# EAGLE design EEG-RM 040218P03 (EAGLE 7.6.0)
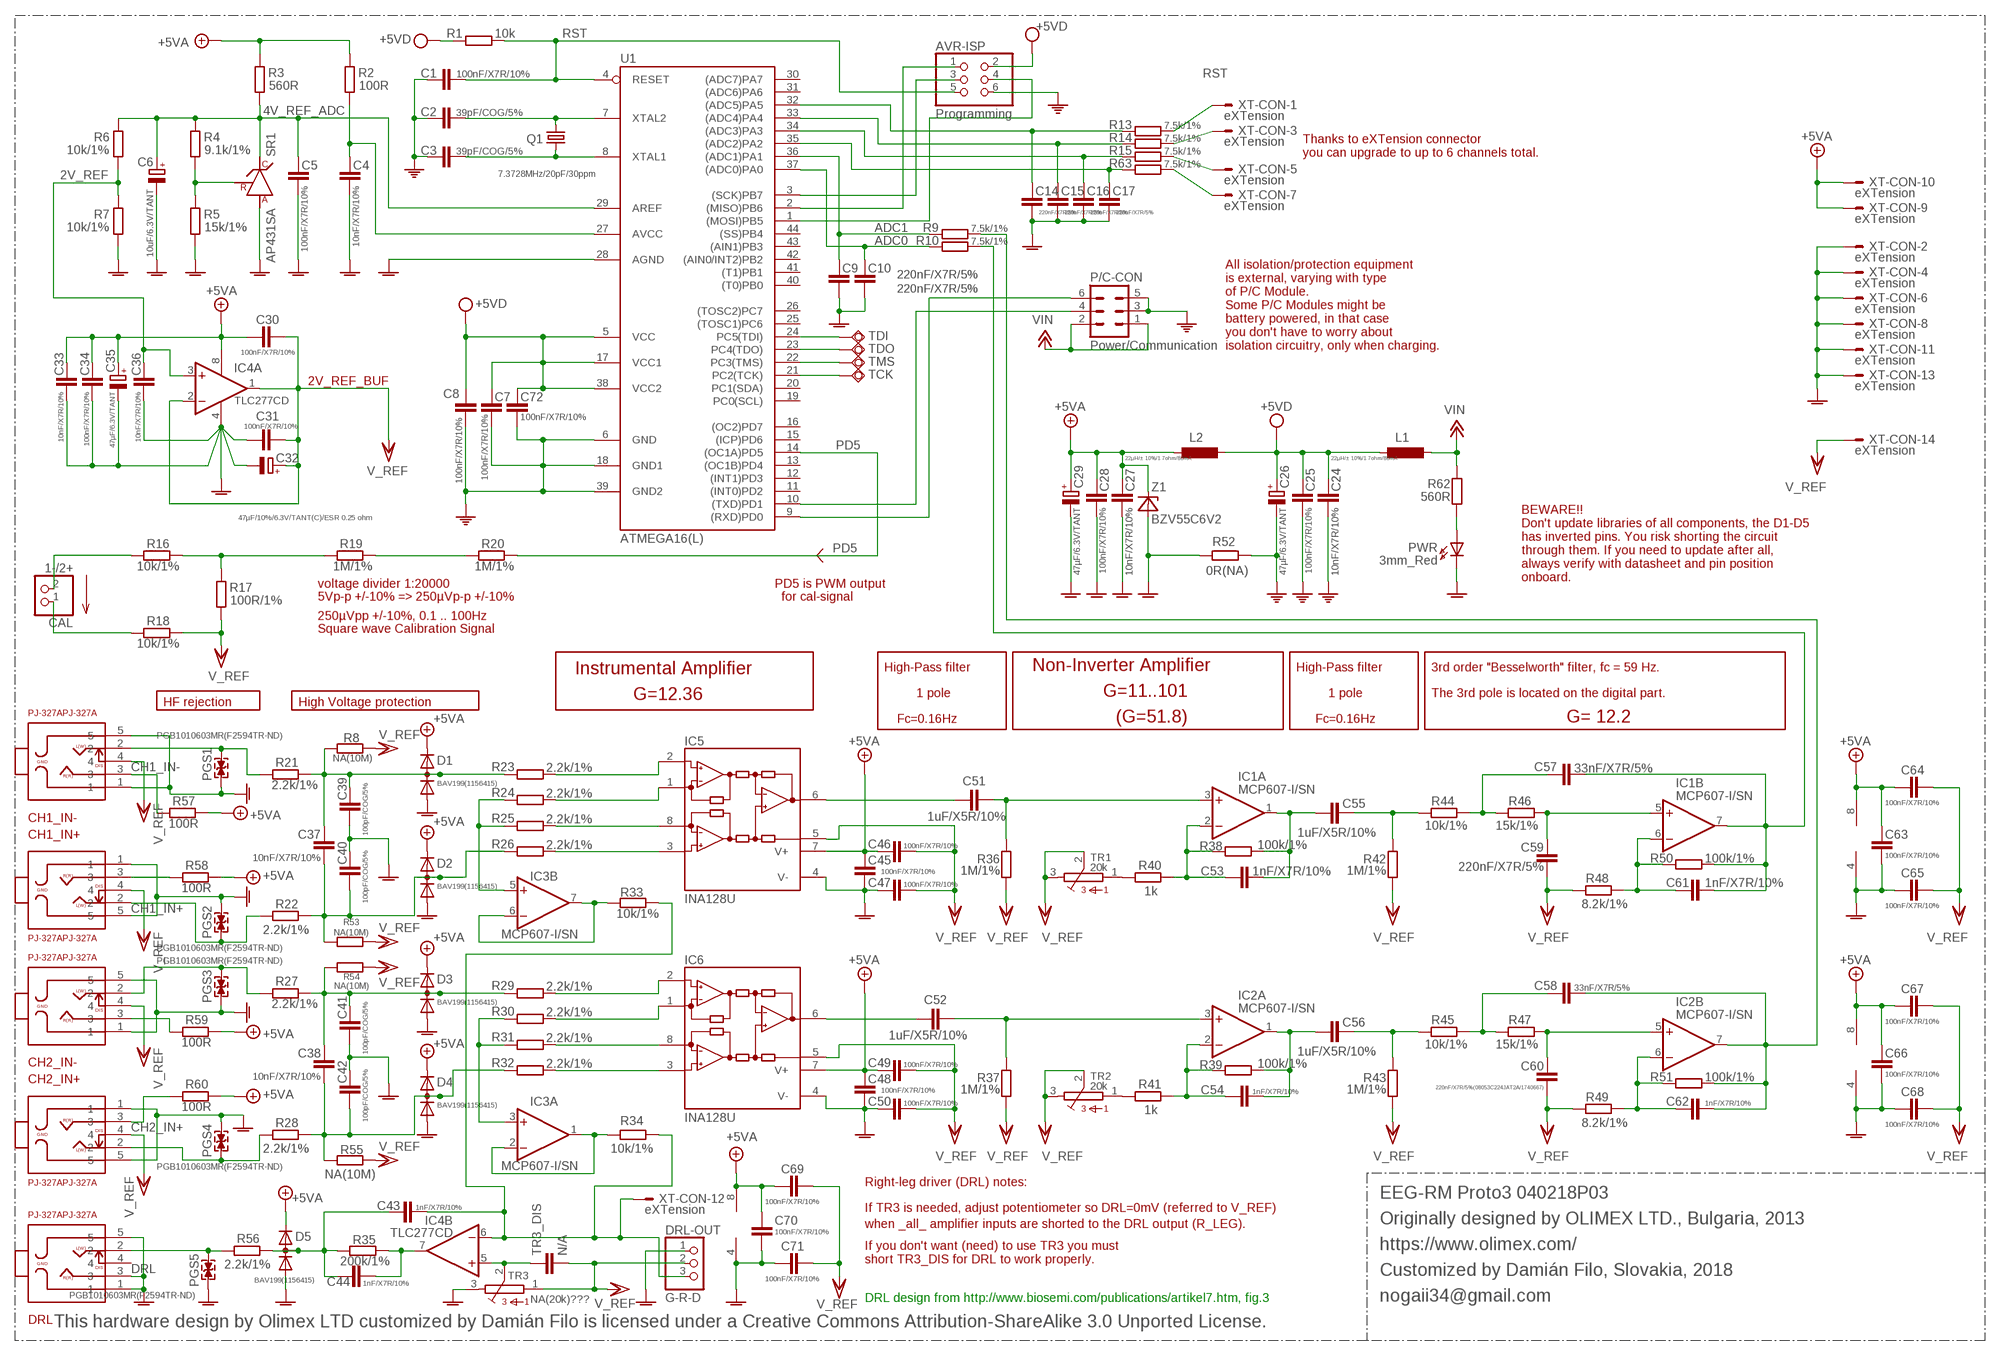
[diagram p0: schematic, sheet 1]

## Parts
AVR-ISP  Programming  PINHD-2X3  [2X03]
C1  100nF/X7R/10%  C-EUC0603  [C0603]
C2  39pF/COG/5%  C-EUC0603  [C0603]
C3  39pF/COG/5%  C-EUC0603  [C0603]
C4  10nF/X7R/10%  C-EUC0603  [C0603]
C5  100nF/X7R/10%  C-EUC0603  [C0603]
C6  10uF/6.3V/TANT  CPOL-EUCT3216  [CT3216]
C7  100nF/X7R/10%  C-EUC0603  [C0603]
C8  100nF/X7R/10%  C-EUC0603  [C0603]
C9  220nF/X7R/5%  C-EUC0603  [C0603]
C10  220nF/X7R/5%  C-EUC0603  [C0603]
C14  220nF/X7R/5%  C-EUC0603  [C0603]
C15  220nF/X7R/5%  C-EUC0603  [C0603]
C16  220nF/X7R/5%  C-EUC0603  [C0603]
C17  220nF/X7R/5%  C-EUC0603  [C0603]
C24  10nF/X7R/10%  C-EUC0603  [C0603]
C25  100nF/X7R/10%  C-EUC0603  [C0603]
C26  47µF/6.3V/TANT  CPOL-EUCT3216  [CT3216]
C27  10nF/X7R/10%  C-EUC0603  [C0603]
C28  100nF/X7R/10%  C-EUC0603  [C0603]
C29  47µF/6.3V/TANT  CPOL-EUCT3216  [CT3216]
C30  100nF/X7R/10%  C-EUC0603  [C0603]
C31  100nF/X7R/10%  C-EUC0603  [C0603]
C32  47µF/10%/6.3V/TANT(C)/ESR 0.25 ohm  CPOL-EUCT3528  [CT3528]
C33  10nF/X7R/10%  C-EUC0603  [C0603]
C34  100nF/X7R/10%  C-EUC0603  [C0603]
C35  47µF/6.3V/TANT  CPOL-EUCT3216  [CT3216]
C36  10nF/X7R/10%  C-EUC0603  [C0603]
C37  10nF/X7R/10%  C-EUC0603  [C0603]
C38  10nF/X7R/10%  C-EUC0603  [C0603]
C39  100pF/COG/5%  C-EUC0603  [C0603]
C40  100pF/COG/5%  C-EUC0603  [C0603]
C41  100pF/COG/5%  C-EUC0603  [C0603]
C42  100pF/COG/5%  C-EUC0603  [C0603]
C43  1nF/X7R/10%  C-EUC0603  [C0603]
C44  1nF/X7R/10%  C-EUC0603  [C0603]
C45  100nF/X7R/10%  C-EUC0603  [C0603]
C46  100nF/X7R/10%  C-EUC0603  [C0603]
C47  100nF/X7R/10%  C-EUC0603  [C0603]
C48  100nF/X7R/10%  C-EUC0603  [C0603]
C49  100nF/X7R/10%  C-EUC0603  [C0603]
C50  100nF/X7R/10%  C-EUC0603  [C0603]
C51  1uF/X5R/10%  C-EUC0603  [C0603]
C52  1uF/X5R/10%  C-EUC0603  [C0603]
C53  1nF/X7R/10%  C-EUC0603  [C0603]
C54  1nF/X7R/10%  C-EUC0603  [C0603]
C55  1uF/X5R/10%  C-EUC0603  [C0603]
C56  1uF/X5R/10%  C-EUC0603  [C0603]
C57  33nF/X7R/5%  C-EUC0603  [C0603]
C58  33nF/X7R/5%  C-EUC0603  [C0603]
C59  220nF/X7R/5%  C-EUC0603  [C0603]
C60  220nF/X7R/5%(08053C224JAT2A/1740667)  C-EUC0603  [C0603]
C61  1nF/X7R/10%  C-EUC0603  [C0603]
C62  1nF/X7R/10%  C-EUC0603  [C0603]
C63  100nF/X7R/10%  C-EUC0603  [C0603]
C64  100nF/X7R/10%  C-EUC0603  [C0603]
C65  100nF/X7R/10%  C-EUC0603  [C0603]
C66  100nF/X7R/10%  C-EUC0603  [C0603]
C67  100nF/X7R/10%  C-EUC0603  [C0603]
C68  100nF/X7R/10%  C-EUC0603  [C0603]
C69  100nF/X7R/10%  C-EUC0603  [C0603]
C70  100nF/X7R/10%  C-EUC0603  [C0603]
C71  100nF/X7R/10%  C-EUC0603  [C0603]
C72  100nF/X7R/10%  C-EUC0603  [C0603]
CAL  1-/2+  PINHD-1X2  [1X02]
CH1_IN+  PJ-327APJ-327A  [PJ-327A]
CH1_IN-  PJ-327APJ-327A  [PJ-327A]
CH2_IN+  PJ-327APJ-327A  [PJ-327A]
CH2_IN-  PJ-327APJ-327A  [PJ-327A]
D1  BAV199(1156415)  DIODE_AC-AC__  [SOT23C]
D2  BAV199(1156415)  DIODE_AC-AC__  [SOT23C]
D3  BAV199(1156415)  DIODE_AC-AC__  [SOT23C]
D4  BAV199(1156415)  DIODE_AC-AC__  [SOT23C]
D5  BAV199(1156415)  DIODE_AC-AC__  [SOT23C]
DRL  PJ-327APJ-327A  [PJ-327A]
DRL-OUT  G-R-D  PINHD-1X3  [1X03]
IC1  MCP607-I/SN  LM358D  [SO08]
IC2  MCP607-I/SN  LM358D  [SO08]
IC3  MCP607-I/SN  LM358D  [SO08]
IC4  TLC277CD  LM358D  [SO08]
IC5  INA128U  [SO08]
IC6  INA128U  [SO08]
L1  22µH/± 10%/1.7ohm/80mA  L-EUL2012C  [L2012C]
L2  22µH/± 10%/1.7ohm/80mA  L-EUL2012C  [L2012C]
P/C-CON  Power/Communication  ML6L  [ML6L]
PGS1  PGB1010603MR(F2594TR-ND)  [0603]
PGS2  PGB1010603MR(F2594TR-ND)  [0603]
PGS3  PGB1010603MR(F2594TR-ND)  [0603]
PGS4  PGB1010603MR(F2594TR-ND)  [0603]
PGS5  PGB1010603MR(F2594TR-ND)  [0603]
PWR  3mm_Red  LED3.0MM  [LED-3.0MM]
Q1  7.3728MHz/20pF/30ppm  HC49/S1  [HC49/SMD2_THIN]
R1  10k  R-EU_R0603  [R0603]
R2  100R  R-EU_R0603  [R0603]
R3  560R  R-EU_R0603  [R0603]
R4  9.1k/1%  R-EU_R0603  [R0603]
R5  15k/1%  R-EU_R0603  [R0603]
R6  10k/1%  R-EU_R0603  [R0603]
R7  10k/1%  R-EU_R0603  [R0603]
R8  NA(10M)  R-EU_R0603  [R0603]
R9  7.5k/1%  R-EU_M2012  [M2012]
R10  7.5k/1%  R-EU_M2012  [M2012]
R13  7.5k/1%  R-EU_M2012  [M2012]
R14  7.5k/1%  R-EU_M2012  [M2012]
R15  7.5k/1%  R-EU_M2012  [M2012]
R16  10k/1%  R-EU_R0603  [R0603]
R17  100R/1%  R-EU_R0603  [R0603]
R18  10k/1%  R-EU_R0603  [R0603]
R19  1M/1%  R-EU_R0603  [R0603]
R20  1M/1%  R-EU_R0603  [R0603]
R21  2.2k/1%  R-EU_R0603  [R0603]
R22  2.2k/1%  R-EU_R0603  [R0603]
R23  2.2k/1%  R-EU_R0603  [R0603]
R24  2.2k/1%  R-EU_R0603  [R0603]
R25  2.2k/1%  R-EU_R0603  [R0603]
R26  2.2k/1%  R-EU_R0603  [R0603]
R27  2.2k/1%  R-EU_R0603  [R0603]
R28  2.2k/1%  R-EU_R0603  [R0603]
R29  2.2k/1%  R-EU_R0603  [R0603]
R30  2.2k/1%  R-EU_R0603  [R0603]
R31  2.2k/1%  R-EU_R0603  [R0603]
R32  2.2k/1%  R-EU_R0603  [R0603]
R33  10k/1%  R-EU_R0603  [R0603]
R34  10k/1%  R-EU_R0603  [R0603]
R35  200k/1%  R-EU_R0603  [R0603]
R36  1M/1%  R-EU_R0603  [R0603]
R37  1M/1%  R-EU_R0603  [R0603]
R38  100k/1%  R-EU_R0603  [R0603]
R39  100k/1%  R-EU_R0603  [R0603]
R40  1k  R-EU_R0603  [R0603]
R41  1k  R-EU_R0603  [R0603]
R42  1M/1%  R-EU_R0603  [R0603]
R43  1M/1%  R-EU_R0603  [R0603]
R44  10k/1%  R-EU_R0603  [R0603]
R45  10k/1%  R-EU_R0603  [R0603]
R46  15k/1%  R-EU_R0603  [R0603]
R47  15k/1%  R-EU_R0603  [R0603]
R48  8.2k/1%  R-EU_R0603  [R0603]
R49  8.2k/1%  R-EU_R0603  [R0603]
R50  100k/1%  R-EU_R0603  [R0603]
R51  100k/1%  R-EU_R0603  [R0603]
R52  0R(NA)  R-EU_R0603  [R0603]
R53  NA(10M)  R-EU_R0603  [R0603]
R54  NA(10M)  R-EU_R0603  [R0603]
R55  NA(10M)  R-EU_R0603  [R0603]
R56  2.2k/1%  R-EU_R0603  [R0603]
R57  100R  R-EU_R0603  [R0603]
R58  100R  R-EU_R0603  [R0603]
R59  100R  R-EU_R0603  [R0603]
R60  100R  R-EU_R0603  [R0603]
R62  560R  R-EU_R0603  [R0603]
R63  7.5k/1%  R-EU_M2012  [M2012]
SR1  AP431SA  TL431'''  [SOT-23]
TCK  TESTPAD80/30  [SMD80/30]
TDI  TESTPAD80/30  [SMD80/30]
TDO  TESTPAD80/30  [SMD80/30]
TMS  TESTPAD80/30  [SMD80/30]
TR1  20k  S64Y  [S64Y]
TR2  20k  S64Y  [S64Y]
TR3  NA(20k)???  S64Y  [S64Y]
TR3_DIS  N/A  C-EUC0402  [C0402]
U1  ATMEGA16(L)  ATMEGA16  [44TQFP]
XT-CON  eXTension  ML14EL  [ML14L]
Z1  BZV55C6V2  ZDIOD-SMD  [MINI-MELF]

## Nets
2V_REF: C36.1 IC4.3(A:+IN) R6.1 R7.2
4V_REF_ADC: C5.1 C6.+ R3.1 R4.2 R6.2 SR1.1(C) U1.29(AREF)
+5V: C27.1 C28.1 C29.+ C30.2 C33.1 C34.1 C35.+ C45.1 C46.1 C48.1 C49.1 C63.1 C64.1 C66.1 C67.1 C69.1 C70.1 D1.1(K) D2.1(K) D3.1(K) D4.1(K) D5.1(K) IC1.8(P:V+) IC2.8(P:V+) IC3.8(P:V+) IC4.8(P:V+) IC5.7(V+) IC6.7(V+) L2.2 R2.2 R3.2 R57.2 R58.2 R59.2 R60.2 XT-CON.9 XT-CON.10 Z1.1(C) ; supply symbol labelled +5VA
+12V: L1.1 P/C-CON.1 P/C-CON.2 R62.2 ; supply symbol labelled VIN
ADC0: C10.1 R10.1 U1.37((ADC0)PA0)
ADC1: C9.1 R9.1 U1.36((ADC1)PA1)
CH1_IN+: CH1_IN+.2 PGS2.1 R22.1
CH1_IN-: CH1_IN-.2 PGS1.2 R21.1
CH2_IN+: CH2_IN+.2 PGS4.1 R28.1
DRL: DRL.2 PGS5.2 R56.1
GNDA [pwr]: C4.2 C5.2 C6.- C9.2 C10.2 C14.2 C15.2 C16.2 C17.2 C27.2 C28.2 C29.- C31.2 C32.- C33.2 C34.2 C35.- C36.2 C39.1 C40.2 C41.1 C42.2 C45.2 C47.1 C48.2 C50.1 C63.2 C65.1 C66.2 C68.1 C70.2 C71.1 CH1_IN+.1 CH1_IN+.5 CH1_IN-.1 CH1_IN-.5 CH2_IN+.1 CH2_IN+.5 CH2_IN-.1 CH2_IN-.5 D1.2(A) D2.2(A) D3.2(A) D4.2(A) D5.2(A) DRL-OUT.1 DRL.1 DRL.3 DRL.5 IC1.4(P:V-) IC2.4(P:V-) IC3.4(P:V-) IC4.4(P:V-) IC5.4(V-) IC6.4(V-) PGS1.1 PGS2.2 PGS3.1 PGS4.2 PGS5.1 PWR.K(C) R5.1 R7.1 R52.1 SR1.3(A) TR3.3 U1.28(AGND) XT-CON.2 XT-CON.4 XT-CON.6 XT-CON.8 XT-CON.11 XT-CON.13 Z1.2(A)
N$1: CH1_IN-.3 R57.1
N$2: CH1_IN+.3 R58.1
N$3: TDI.P$1(PP) U1.24(PC5(TDI))
N$4: TDO.P$1(PP) U1.23(PC4(TDO))
N$5: TMS.P$1(PP) U1.22(PC3(TMS))
N$6: TCK.P$1(PP) U1.21(PC2(TCK))
N$7: CH2_IN-.3 R59.1
N$9: C43.2 C44.2 D5.3(AK) R35.1 R56.2
N$10: CH2_IN+.3 R60.1
N$11: PWR.A R62.1
N$12: R13.2 XT-CON.1
N$13: AVR-ISP.1 U1.2((MISO)PB6)
N$14: AVR-ISP.3 U1.3((SCK)PB7)
N$15: R14.2 XT-CON.3
N$16: AVR-ISP.4 U1.1((MOSI)PB5)
N$17: R15.2 XT-CON.5
N$18: R63.2 XT-CON.7
N$21: C4.1 R2.1 U1.27(AVCC)
N$22: R4.1 R5.2 SR1.2(R)
N$23: P/C-CON.4 U1.10((TXD)PD1)
N$24: P/C-CON.6 U1.9((RXD)PD0)
N$25: C17.1 R63.1 U1.35((ADC2)PA2)
N$26: C16.1 R15.1 U1.34((ADC3)PA3)
N$27: C3.1 Q1.2 U1.8(XTAL1)
N$28: C2.1 Q1.1 U1.7(XTAL2)
N$29: R40.2 TR1.1
N$30: R41.2 TR2.1
N$31: CH2_IN-.2 PGS3.2 R27.1
N$35: C14.1 R13.1 U1.32((ADC5)PA5)
N$36: C15.1 R14.1 U1.33((ADC4)PA4)
N$81: C55.2 R42.1 R44.1
N$83: C51.1 IC5.6(OUT)
N$84: IC5.2(-IN) R23.1
N$88: IC5.1(RG) R24.1
N$92: C37.1 C40.1 D2.3(AK) R22.2 R26.2 R53.2
N$93: C37.2 C39.2 D1.3(AK) R8.2 R21.2 R23.2
N$94: C38.1 C42.1 D4.3(AK) R28.2 R32.2 R55.2
N$95: C38.2 C41.2 D3.3(AK) R27.2 R29.2 R54.2
N$101: IC5.8(RG) R25.1
N$102: C51.2 IC1.3(A:+IN) R36.1
N$103: IC3.5(B:+IN) R24.2 R25.2
N$104: C53.2 C55.1 IC1.1(A:OUT) R38.2
N$105: C53.1 IC1.2(A:-IN) R38.1 R40.1
N$106: IC5.3(+IN) R26.1
N$107: C59.1 IC1.5(B:+IN) R46.2
N$108: C57.1 R44.2 R46.1
N$109: C57.2 C61.2 IC1.7(B:OUT) R10.2 R50.2
N$110: C61.1 IC1.6(B:-IN) R48.1 R50.1
N$113: C52.2 IC2.3(A:+IN) R37.1
N$125: C54.2 C56.1 IC2.1(A:OUT) R39.2
N$126: C54.1 IC2.2(A:-IN) R39.1 R41.1
N$127: C60.1 IC2.5(B:+IN) R47.2
N$128: C58.1 R45.2 R47.1
N$129: C58.2 C62.2 IC2.7(B:OUT) R9.2 R51.2
N$130: C62.1 IC2.6(B:-IN) R49.1 R51.1
N$131: C56.2 R43.1 R45.1
N$133: C52.1 IC6.6(OUT)
N$134: IC6.1(RG) R30.1
N$135: IC6.8(RG) R31.1
N$136: IC3.3(A:+IN) R30.2 R31.2
N$137: IC6.2(-IN) R29.1
N$138: IC6.3(+IN) R32.1
N$139: IC3.1(A:OUT) IC3.2(A:-IN) R34.2
N$140: IC3.6(B:-IN) IC3.7(B:OUT) R33.2
N$141: IC4.5(B:+IN) TR3.2 TR3_DIS.1
N$142: C44.1 IC4.7(B:OUT) R35.2
N$144: R19.2 R20.1
N$145: C43.1 DRL-OUT.3 IC4.6(B:-IN) R33.1 R34.1 XT-CON.12
N$146: R16.2 R17.2 R19.1
N$148: CAL.2 R16.1
N$149: CAL.1 R18.1
PD5: R20.2 U1.14((OC1A)PD5)
PE: AVR-ISP.6 C1.2 C2.2 C3.2 C7.2 C8.2 C24.2 C25.2 C26.- C72.2 P/C-CON.3 P/C-CON.5 R52.2 U1.6(GND) U1.18(GND1) U1.39(GND2)
RST: AVR-ISP.5 C1.1 R1.2 U1.4(RESET)
VCC/2: C30.1 C31.1 C32.+ C46.2 C47.2 C49.2 C50.2 C59.2 C60.2 C64.2 C65.2 C67.2 C68.2 C69.2 C71.2 CH1_IN+.4 CH1_IN-.4 CH2_IN+.4 CH2_IN-.4 DRL-OUT.2 IC4.1(A:OUT) IC4.2(A:-IN) IC5.5(REF) IC6.5(REF) R8.1 R17.1 R18.2 R36.2 R37.2 R42.2 R43.2 R48.2 R49.2 R53.1 R54.1 R55.1 TR1.2 TR1.3 TR2.2 TR2.3 TR3.1 TR3_DIS.2 XT-CON.14 ; supply symbol labelled V_REF
VPP: AVR-ISP.2 C7.1 C8.1 C24.1 C25.1 C26.+ C72.1 L1.2 L2.1 R1.1 U1.5(VCC) U1.17(VCC1) U1.38(VCC2) ; supply symbol labelled +5VD
Unconnected: DRL.4 U1.11((INT0)PD2) U1.12((INT1)PD3) U1.13((OC1B)PD4) U1.15((ICP)PD6) U1.16((OC2)PD7) U1.19(PC0(SCL)) U1.20(PC1(SDA)) U1.25((TOSC1)PC6) U1.26((TOSC2)PC7) U1.30((ADC7)PA7) U1.31((ADC6)PA6) U1.40((T0)PB0) U1.41((T1)PB1) U1.42((AIN0/INT2)PB2) U1.43((AIN1)PB3) U1.44((SS)PB4)

## Notes on the sheet
- Thanks to eXTension connector
  you can upgrade to up to 6 channels total.
- All isolation/protection equipment 
  is external, varying with type
  of P/C Module.
  Some P/C Modules might be
  battery powered, in that case
  you don't have to worry about
  isolation circuitry, only when charging.
- 2V_REF_BUF
- BEWARE!!
  Don't update libraries of all components, the D1-D5
  has inverted pins. You risk shorting the circuit
  through them. If you need to update after all,
  always verify with datasheet and pin position
  onboard.
- voltage divider 1:20000 | PD5 is PWM output
- 5Vp-p +/-10% => 250µVp-p +/-10% | for cal-signal
- 250µVpp +/-10%, 0.1 .. 100Hz
- Square wave Calibration Signal
- Instrumental Amplifier | High-Pass filter | Non-Inverter Amplifier | High-Pass filter | 3rd order "Besselworth" filter, fc = 59 Hz.
- HF rejection | High Voltage protection | G=12.36 | 1 pole | G=11..101 | 1 pole | The 3rd pole is located on the digital part.
- Fc=0.16Hz | (G=51.8) | Fc=0.16Hz | G= 12.2
- Right-leg driver (DRL) notes:
- EEG-RM Proto3 040218P03
- If TR3 is needed, adjust potentiometer so DRL=0mV (referred to V_REF)
- when _all_ amplifier inputs are shorted to the DRL output (R_LEG). | Originally designed by OLIMEX LTD., Bulgaria, 2013
- https://www.olimex.com/
- If you don't want (need) to use TR3 you must
  short TR3_DIS for DRL to work properly.
- Customized by Damián Filo, Slovakia, 2018
- DRL design from http://www.biosemi.com/publications/artikel7.htm, fig.3 | nogaii34@gmail.com
- This hardware design by Olimex LTD customized by Damián Filo is licensed under a Creative Commons Attribution-ShareAlike 3.0 Unported License.

## Library data of the parts
AVR-ISP = pinhead:PINHD-2X3: PIN HEADER
C1-C5 C7-C10 C14-C17 C24 C25 C27 C28 C30 C31 C33 C34 C36-C72 TR3_DIS = rcl:C-EU: CAPACITOR, European symbol
C6 C26 C29 C32 C35 = rcl:CPOL-EU: POLARIZED CAPACITOR, European symbol
CAL = pinhead:PINHD-1X2: PIN HEADER
CH1_IN+ CH1_IN- CH2_IN+ CH2_IN- DRL = aud:PJ-327A
D1-D5 = semicon-smd-ipc:DIODE_AC-AC_: DUAL DIODE
DRL-OUT = pinhead:PINHD-1X3: PIN HEADER
IC1-IC4 = linear:LM358: OP AMP also LM158; LM258; LM2904 Source: http://cache.national.com/ds/LM/LM158.pdf
IC5 IC6 = burr-brown:INA128: Instrumentation Amplifiers Precision, Low Power; MF: TEXAS INSTRUMENTS; MPN: INA128U; OC_FARNELL: 1212413; OC_NEWARK: 35C1729
L1 L2 = rcl:L-EU: INDUCTOR, European symbol
P/C-CON = con-harting-ml:ML6: HARTING
PGS1-PGS5 = OLIMEX_DISCRET:PGB1010603MR: PulseGuard® Suppressors Surface Mount Polymeric ESD Suppressors
PWR = DOUBLE-SIDE:LED
Q1 = crystal:HC49/S: CRYSTAL
R1-R10 R13-R60 R62 R63 = rcl:R-EU_: RESISTOR, European symbol
SR1 = OLIMEX_IC:TL431: TL431 Programmable Shunt Regulator Features: -> Programmable Output Voltage to 36 Volts -> Low Dynamic Output Impedance 0.20 Typical -> Sink Current Capability of 1.0 to 100mA -> Equivalent Full-Range Temperature Coefficient of 50ppm/°C Typical -> Temperature Compensated For Operation Over Full Rated Operating Temperature Range -> Low Output Noise Voltage -> Fast Turn-on Response
TCK TDI TDO TMS = gogo:TESTPAD: drill 40mils, diameter 70mils
TR1-TR3 = TRIMPOT:S64Y
U1 = gogo:ATMEGA16
XT-CON = con-harting-ml:ML14E: HARTING
Z1 = gogo:ZDIOD-SMD

## Net classes
1 pwr: width 0.4 mm, clearance 0.23 mm

## Board
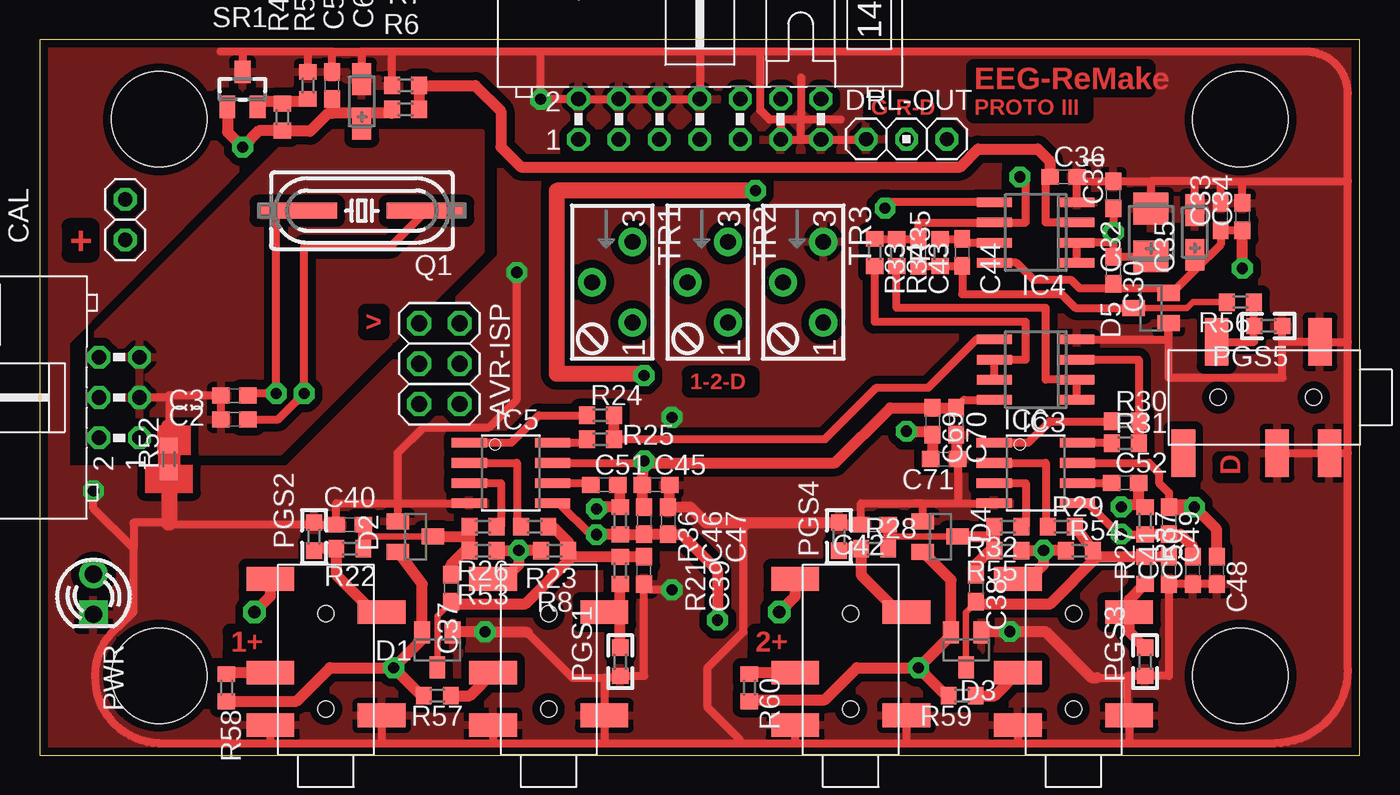
[diagram p1: board, top side]
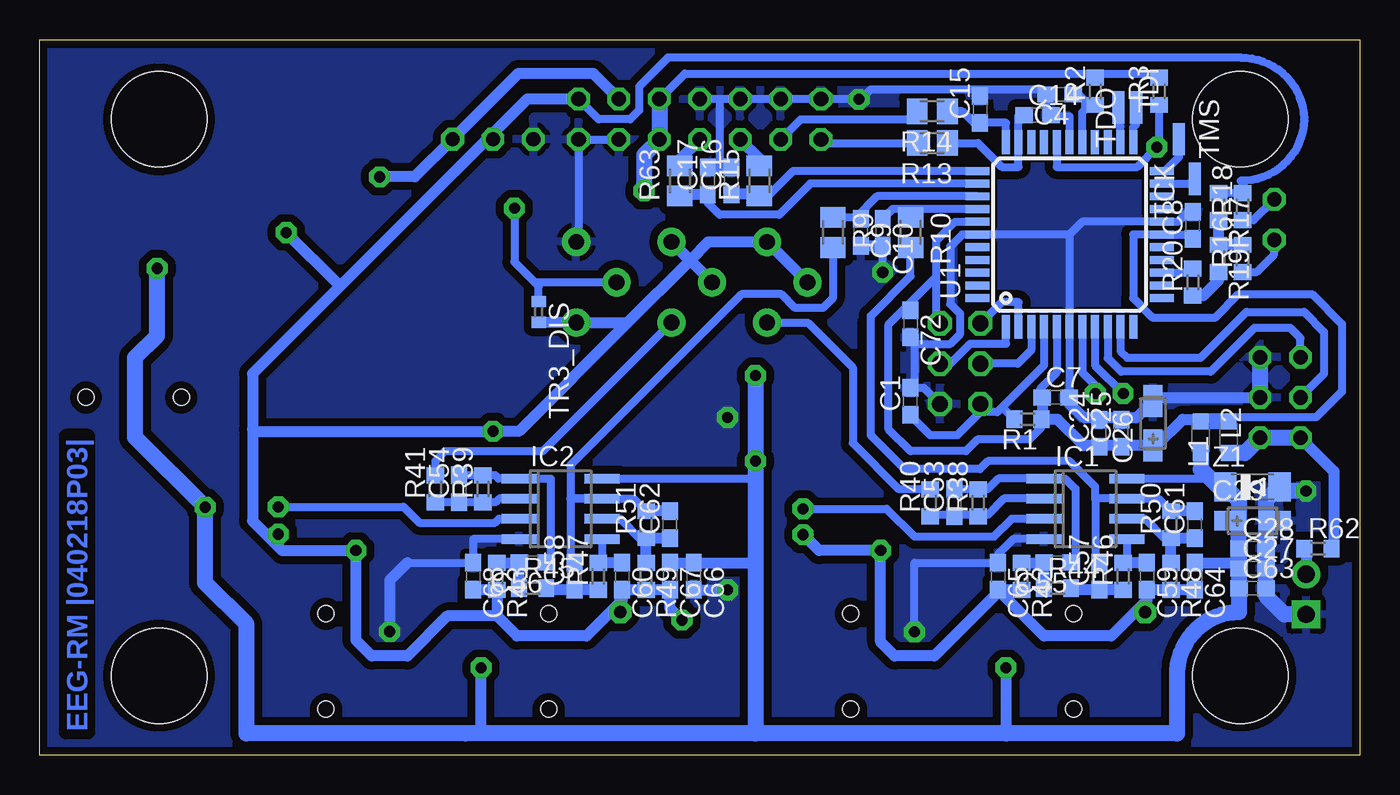
[diagram p2: board, bottom side, seen from below]

Size 83 x 45 mm. Coordinates in mm from the lower left corner, seen from the top.
Outline: 0,0 83,0 83,45 0,45 0,0
Copper layers (1*16): Top 0.035mm / dielectric 1.5mm / Bottom 0.035mm
Design rules "default *": minimum track width 10mil, minimum drill 24mil, track to track 8mil, track to pad 8mil, pad to pad 8mil, via to via 8mil, smd to smd 8mil, copper to edge 0.5mm, drill to drill 0.5mm, minimum pad ring 10mil, minimum via ring 12mil, stop-mask expansion 4mil, vias tented up to drill 0mil, thermal gap 0.35mm
Holes 6 mm at 75.5,5 7.5,5 7.5,40 75.5,40

### Footprints (pad centres in the part's own frame; a part is rotated, then mirrored left to right if it is on the bottom)
2X03 = drill 1.016 octagon: 1 -2.54,-1.27; 2 -2.54,1.27; 3 0,-1.27; 4 0,1.27; 5 2.54,-1.27; 6 2.54,1.27
C0603 = smd 1.1 x 1: 1 -0.85,0; 2 0.85,0
CT3216 = smd 2 x 1.2: + -1.4,0; - 1.4,0
CT3528 = smd 2 x 2.2: + -1.5,0; - 1.5,0
1X02 = drill 0.9 pad 1.422 octagon: 1 -1.27,0; 2 1.27,0
PJ-327A = smd 3 x 1.5: 1 -3.5,3.5; 2 -3.5,-3; 3 3.5,0.8; 4 3.5,-5.1; 5 3.5,4.1 | hole 1: 0,3.1; 0,-2.9
SOT23C = smd 1 x 1.4: 1 0.955,-1.1; 2 -0.955,-1.1; 3 0,1.1
1X03 = drill 0.9 pad 1.422 octagon: 1 -2.54,0; 2 0,0; 3 2.54,0
SO08 = smd 0.6 x 2.2: 1 -1.905,-2.6; 2 -0.635,-2.6; 3 0.635,-2.6; 4 1.905,-2.6; 5 1.905,2.6; 6 0.635,2.6; 7 -0.635,2.6; 8 -1.905,2.6
SO08' = smd 0.61 x 2.21: 1 -1.905,-2.616; 2 -0.635,-2.616; 3 0.635,-2.616; 4 1.905,-2.616; 5 1.905,2.616; 6 0.635,2.616; 7 -0.635,2.616; 8 -1.905,2.616
L2012C = smd 1 x 1: 1 -1,0; 2 1,0
ML6L = drill 0.914 octagon: 1 -2.54,-1.27; 2 -2.54,1.27; 3 0,-1.27; 4 0,1.27; 5 2.54,-1.27; 6 2.54,1.27
0603 = smd 1.016 x 1.016: 1 -0.889,0; 2 0.889,0
LED-3.0MM = drill 1.092 pad 1.778: A -1.27,0 | drill 1.092 pad 1.778 square: K 1.27,0
HC49/SMD2_THIN = smd 5 x 1: 1 -4.064,0; 2 4.064,0
R0603 = smd 1 x 1.1: 1 -0.85,0; 2 0.85,0
M2012 = smd 1.3 x 1.6: 1 -0.95,0; 2 0.95,0
SOT-23 = smd 1 x 1.4: 1 -0.95,-1.1; 2 0.95,-1.1; 3 0,1.1
SMD80/30 = smd 2.032 x 0.762: P$1 0,0
S64Y = drill 0.991 pad 1.778: 1 2.54,1.27; 2 0,-1.27; 3 -2.54,1.27
C0402 = smd 0.7 x 0.9: 1 -0.65,0; 2 0.65,0
44TQFP = smd 1.5 x 0.5: 1 -5.8,4; 2 -5.8,3.2; 3 -5.8,2.4; 4 -5.8,1.6; 5 -5.8,0.8; 6 -5.8,0; 7 -5.8,-0.8; 8 -5.8,-1.6; 9 -5.8,-2.4; 10 -5.8,-3.2; 11 -5.8,-4; 23 5.8,-4; 24 5.8,-3.2; 25 5.8,-2.4; 26 5.8,-1.6; 27 5.8,-0.8; 28 5.8,0; 29 5.8,0.8; 30 5.8,1.6; 31 5.8,2.4; 32 5.8,3.2; 33 5.8,4 | smd 0.5 x 1.5: 12 -4,-5.8; 13 -3.2,-5.8; 14 -2.4,-5.8; 15 -1.6,-5.8; 16 -0.8,-5.8; 17 0,-5.8; 18 0.8,-5.8; 19 1.6,-5.8; 20 2.4,-5.8; 21 3.2,-5.8; 22 4,-5.8; 34 4,5.8; 35 3.2,5.8; 36 2.4,5.8; 37 1.6,5.8; 38 0.8,5.8; 39 0,5.8; 40 -0.8,5.8; 41 -1.6,5.8; 42 -2.4,5.8; 43 -3.2,5.8; 44 -4,5.8
ML14L = drill 0.914 octagon: 1 -7.62,-1.27; 2 -7.62,1.27; 3 -5.08,-1.27; 4 -5.08,1.27; 5 -2.54,-1.27; 6 -2.54,1.27; 7 0,-1.27; 8 0,1.27; 9 2.54,-1.27; 10 2.54,1.27; 11 5.08,-1.27; 12 5.08,1.27; 13 7.62,-1.27; 14 7.62,1.27
MINI-MELF = smd 1.4 x 1.8: 1 -1.7,0; 2 1.7,0

### Placement (x,y rotation side)
AVR-ISP  25.12,24.62 270 top
C1  28.25,22.25 90 bottom
C2  12.25,21.12 180 top
C3  12.25,22.62 180 top
C4  18.88,41.56 180 bottom
C5  18.38,42.12 90 top
C6  20.25,41.12 90 top
C7  19.12,22.5 0 bottom
C8  10.5,33.31 90 bottom
C9  31.38,32.88 270 bottom
C10  30,32.88 270 bottom
C14  20.25,40.25 0 bottom
C15  23.88,40.62 90 bottom
C16  39.5,36.12 90 bottom
C17  41,36.12 90 bottom
C24  16.38,20.25 90 bottom
C25  15,20.25 90 bottom
C26  13,20.88 90 bottom
C27  6.75,11.75 0 bottom
C28  6.75,13 0 bottom
C29  6.75,14.75 0 bottom
C30  67.5,30.5 270 top
C31  67.5,35.25 90 top
C32  69.88,32.88 90 top
C33  74.25,33.88 90 top
C34  75.62,33.88 90 top
C35  72.62,32.88 90 top
C36  64.38,36.38 0 top
C37  25.88,10.5 270 top
C38  58.88,10.5 270 top
C39  38,11.62 90 top
C40  19.5,14.5 180 top
C41  71,11.62 90 top
C42  52.5,14.5 180 top
C43  55.25,31.62 270 top
C44  58,31.62 270 top
C45  38.75,17 0 top
C46  38,14.75 270 top
C47  39.5,14.75 270 top
C48  74,11.62 270 top
C49  71,14.75 270 top
C50  72.5,11.62 90 top
C51  35.5,17 0 top
C52  68.25,17.12 0 top
C53  25.5,15.88 90 bottom
C54  56.62,16.75 90 bottom
C55  19,12.12 180 bottom
C56  52,12.12 180 bottom
C57  16.38,11.25 90 bottom
C58  49.38,11.25 90 bottom
C59  13.38,11.25 270 bottom
C60  46.38,11.25 270 bottom
C61  10.38,14.5 90 bottom
C62  43.38,14.5 90 bottom
C63  6.75,10.5 0 bottom
C64  10.38,11.25 270 bottom
C65  22.75,11.25 270 bottom
C66  41.88,11.25 270 bottom
C67  43.38,11.25 270 bottom
C68  55.75,11.25 270 bottom
C69  56.12,21 270 top
C70  57.62,21 270 top
C71  56.88,18.62 180 top
C72  28.25,27.12 270 bottom
CAL  5.38,33.69 270 top
CH1_IN+  18,6 180 top
CH1_IN-  32,6 180 top
CH2_IN+  51,6 180 top
CH2_IN-  65,6 180 top
D1  25,6.62 180 top
D2  23.62,13.75 270 top
D3  58.25,6.62 180 top
D4  56.62,13.75 270 top
D5  69.88,28.12 90 top
DRL  77,22.5 270 top
DRL-OUT  54.5,38.75 0 top
IC1  17.25,15.5 270 bottom
IC2  50.25,15.5 270 bottom
IC3  62.62,24.25 90 top
IC4  62.62,32.88 90 top
IC5  INA128U  [SO08']  29.62,17.75 270 top
IC6  INA128U  [SO08']  62.62,17.75 270 top
L1  8.25,20 90 bottom
L2  10,20 270 bottom
P/C-CON  5,22.5 90 top
PGS1  36.5,5.88 90 top
PGS2  17.25,13.75 90 top
PGS3  69.5,5.88 90 top
PGS4  50.25,13.75 90 top
PGS5  77.25,27 180 top
PWR  3.38,10.12 270 top
Q1  20.25,34.25 180 top
R1  20.88,21.12 180 bottom
R2  16.62,41.75 90 bottom
R3  12.62,41.75 90 bottom
R4  15.25,40.12 270 top
R5  16.88,42.12 270 top
R6  23,40.62 180 top
R7  23,42.12 0 top
R8  32.38,12.88 0 top
R9  33.12,32.88 270 bottom
R10  28.25,32.88 270 bottom
R13  26.88,38.5 180 bottom
R14  26.88,40.5 180 bottom
R15  37.75,36.12 90 bottom
R16  7.38,31.25 90 bottom
R17  8.88,34.5 270 bottom
R18  7.38,34.5 90 bottom
R19  8.88,31.25 270 bottom
R20  10.5,29.75 90 bottom
R21  36.5,11.62 90 top
R22  19.5,13 0 top
R23  31.12,14.38 0 top
R24  35.25,21.38 0 top
R25  35.25,19.88 0 top
R26  27.88,14.38 180 top
R27  69.5,11.62 90 top
R28  52.5,13 0 top
R29  64.25,14.38 0 top
R30  68.25,21 0 top
R31  68.25,19.62 0 top
R32  60.88,14.38 180 top
R33  52.5,31.62 270 top
R34  53.88,31.62 270 top
R35  56.62,31.62 90 top
R36  36.5,14.75 270 top
R37  69.5,14.75 270 top
R38  24,15.88 90 bottom
R39  55.12,16.75 90 bottom
R40  27,15.88 90 bottom
R41  58.12,16.75 90 bottom
R42  21.25,11.25 270 bottom
R43  54.25,11.25 270 bottom
R44  19,10.5 0 bottom
R45  52,10.5 0 bottom
R46  14.88,11.25 90 bottom
R47  47.88,11.25 90 bottom
R48  11.88,11.25 270 bottom
R49  44.88,11.25 270 bottom
R50  11.88,14.5 90 bottom
R51  44.88,14.5 90 bottom
R52  8.12,18.62 90 top
R53  27.88,12.88 180 top
R54  65.38,12.88 0 top
R55  60.88,12.88 180 top
R56  75.5,28.5 180 top
R57  25,3.75 180 top
R58  11.75,4.25 270 top
R59  58,3.75 180 top
R60  44.62,4.25 270 top
R62  2.62,13 0 bottom
R63  42.75,36.12 90 bottom
SR1  12.75,41.88 0 top
TCK  10.38,36.25 90 bottom
TDI  15.19,40.75 270 bottom
TDO  14.06,40.75 90 bottom
TMS  11.38,38.75 270 bottom
TR1  36,29.75 270 top
TR2  42,29.75 270 top
TR3  48,29.75 270 top
TR3_DIS  51.62,27.88 270 bottom
U1  18.25,32.75 90 bottom
XT-CON  41.5,40 0 top
Z1  6.75,16.88 0 bottom

### Tracks (layer width: path | path; a pad name or v marks a point on that pad's centre or on a via)
2V_REF
  Top 0.5: IC4.3 63.25,33.51 63.25,36.38 C36.1
  Top 0.7: R6.1 R7.2 27.38,42.12 29,40.5 29,38.25 30.25,37 57.88,37 59,38.12 62.75,38.12 63.5,37.38 63.5,36.4 C36.1
4V_REF_ADC  (via drill 0.7)
  Top 0.7: SR1.1 11.8,39.2 v12.75,38.25 13.78,39.27 R4.2 15.28,39.25 17,39.25 18.12,40.38 18.38,40.38 | R6.2 22.15,40.38 20.12,40.38 | 20.12,40.38 18.38,40.38 | C5.1 18.38,40.38 | C6.+ 20.25,40.25 20.12,40.38
  Bottom 0.5: U1.29 19.05,37 14,37 v12.75,38.25 12.62,38.38 R3.1
+5V  (via drill 0.7)
  Top 0.5: IC5.7 38,18.39 v38,18.5 | IC6.7 69.74,18.39 70.38,17.75 70.38,17.12 71,16.5 C49.1 | C70.1 58.12,22.34 IC3.8 | 72.62,30.5 C35.+ | C34.1 C33.1 74.25,32.12 72.62,30.5 | 67.5,29.38 65.38,29.38 64.88,29.88 62.5,29.88 61.41,30.97 IC4.8 | 67.5,29.38 71,29.38 | 71,29.38 71.5,29.38 72.62,30.5 | D5.1 70.97,29.35 71,29.38 | C30.2 67.5,29.38
  Top 0.7: 37.9,18.4 v38,18.5 | C46.1 37.9,15.6 C45.1 37.9,18.39 38,18.39 50.01,18.39 53.48,21.85 C69.1 C70.1 | 72.65,15.65 v72.6,15.6 74,14.2 C48.1 | R59.2 57,3.75 v55.25,5.5 | v55.25,5.5 57.3,7.54 D3.1 57.3,11.03 D4.1 | R60.2 44.73,3.5 49.38,3.5 51.38,5.5 v55.25,5.5 | R57.2 24,3.75 v22.25,5.5 | v22.25,5.5 24.05,7.29 D1.1 24.05,10.78 D2.1 | R58.2 16.15,3.4 18.25,5.5 v22.25,5.5 | v75.62,30.62 C34.1
  Top 1: C49.1 v72.6,15.6 | v45,35.5 32.5,35.5 32.5,24 38,24 v38,23.88
  Bottom 0.5: XT-CON.10 42.44,42.88 16.5,42.88 | 16.5,42.88 12.9,42.88 R3.2 | R2.2 16.62,42.75 16.5,42.88 | IC1.8 8.98,17.41 Z1.1 | IC2.8 38.09,17.41 38,17.5
  Bottom 0.7: v22.25,5.5 22.25,1.38 | C64.1 8,12.1 7.6,12.5 | C67.1 C66.1 38.1,12.1 38,12 | 56.25,1.38 55.25,1.38 v55.25,5.5
  Bottom 1: XT-CON.10 XT-CON.9 45,37.77 v45,35.5 | L2.2 10,18 8.69,16.69 8.64,16.69 Z1.1 7.6,16.02 7.6,14.75 | 7.6,14.75 C28.1 7.6,12.5 C27.1 C63.1 7.6,9 arc-90 11.5,5 11.5,1.38 22.25,1.38 38,1.38 | C29.+ 7.6,14.75 | 38,1.38 56.25,1.38 70,1.38 70,8.25 72.6,10.85 v72.6,15.6 77,20 77,25 75.62,26.38 v75.62,30.62 | 38,1.38 38,12 38,17.5 v38,18.5 v38,23.88
+12V
  Bottom 0.7: P/C-CON.2 1.62,17.86 1.62,13.15 R62.2
  Bottom 1: P/C-CON.2 P/C-CON.1 7.23,19 L1.1
ADC0
  Bottom 0.5: U1.37 28,34.35 | 28,34.35 29.38,34.35 C10.1 | R10.1 28.25,34.1 28,34.35
ADC1
  Bottom 0.5: 32.88,34.12 R9.1 31.68,33.83 | U1.36 30.35,35.15 31.68,33.83 | C9.1 31.35,33.83 31.68,33.83
CH1_IN+
  Top 0.7: CH1_IN+.2 21,9 18.65,11.35 R22.1 17.39,13 PGS2.1
CH1_IN-
  Top 0.7: PGS1.2 36.5,8.75 36.25,9 | 36.25,9 CH1_IN-.2 | 36.25,9 36.5,9.25 R21.1
CH2_IN+
  Top 0.7: CH2_IN+.2 54,9 51.65,11.35 R28.1 50.39,13 PGS4.1
DRL
  Top 0.5: DRL.2 76.35,26 PGS5.2 | PGS5.2 R56.1 | PGS5.2
GNDA  (via drill 0.7)
  Top 0.5: 41.48,41.27 XT-CON.2 31.5,41.27 31.5,44.25 | 82.25,19 82.25,5.38 arc-90 77.62,0.75 61.5,0.75 | 82.25,19 82.25,26 | 82.25,26 82.25,36.1 | 82.25,36.1 82.25,41.62 arc90 79.62,44.25 31.5,44.25 | DRL.3 DRL.5 82.25,19 | 82.25,26 DRL.1 78.14,26 | C28.2 5.9,9.03 5,8.12 arc53 3.5,5 arc90 7.5,0.75 11.5,0.75 | C28.2 3.38,15.53 v3.38,16.62 | v39.75,10.4 38.38,10.4 C39.1 38,4.99 PGS1.1 36.5,4.88 35.5,4.88 | 18.38,44.25 20.25,44.25 | 20.25,44.25 C6.- | 22.15,44.25 20.25,44.25 | R7.1 22.15,44.25 | XT-CON.8 41.5,44.25 45.31,44.25 45.31,40.56 45.88,40 46.62,40 | 11.5,0.75 14.5,0.75 | 14.5,0.75 21.5,0.75 | 21.5,0.75 28.5,0.75 | 28.5,0.75 35.5,0.75 | 35.5,0.75 44,0.75 | 44,0.75 47.5,0.75 | 47.5,0.75 54.5,0.75 | 54.5,0.75 61.5,0.75 | CH1_IN+.5 14.5,0.75 | 11.49,0.76 11.5,0.75 | CH1_IN+.1 21.5,0.75 | CH1_IN-.5 28.5,0.75 | 35.5,0.75 CH1_IN-.1 35.5,4.88 | CH2_IN+.5 47.5,0.75 | CH2_IN+.1 54.5,0.75 | CH2_IN-.5 61.5,0.75 | 66.5,4.88 68.38,4.88 | 68.38,4.88 68.38,2.5 CH2_IN-.1 68.5,1 | 68.38,4.88 68.38,4.99 PGS3.1 71,4.99 C41.1 C50.1 C48.2 | 47.88,42.62 47.88,40 | 47.88,38.75 47.88,38.73 XT-CON.11 XT-CON.13 | XT-CON.13 49.12,38.75 47.88,38.75 | 47.88,38.75 47.88,40 | C28.2 5.9,14.64 8.12,14.64 8.26,14.5 17.5,14.5 | 46.62,38.75 46.62,40 | 46.62,40 47.88,40 | C42.2 51.65,15.85 55,15.85 | 55,15.85 57.73,15.85 | 57.73,15.85 IC6.4 | XT-CON.13 52,38.73 | C5.2 18.38,44.25 | 18.38,44.25 16.88,44.25 | 16.88,44.25 12.75,44.25 | R5.1 16.88,44.25 | 12.75,44.25 11.38,44.25 | 12.75,44.25 SR1.3 | 47.88,40 50.38,40 | PGS2.2 17.36,14.64 17.5,14.5 | 44,0.75 44,1 42,3 42,5.5 44.25,7.75 44.25,14.26 44.62,14.64 | D4.2 55.52,15.82 55,15.85 | 17.5,14.5 C40.2 18.65,15.85 22.52,15.85 | 22.52,15.85 IC5.4
  Top 0.5: D2.2 22.52,15.85 | 35.5,4.88 33.5,4.88 30.65,7.72 | v30,30.38 30,22.38 28.25,20.62 24.12,20.62 22.5,19 22.5,15.87 22.52,15.85 | 31.5,44.25 22.15,44.25 | C71.1 57.73,15.85 | IC4.4 C36.2 65.22,36.1 C31.2 69.88,36.1 | 69.88,36.1 C32.- | C35.- 72.62,36.1 | 72.62,36.1 69.88,36.1 | C33.2 74.25,36.1 | 74.25,36.1 72.62,36.1 | C34.2 75.62,36.1 | IC3.4 70.97,26.16 D5.2 70.97,23.75 78.14,23.75 78.14,26 | 78.14,26 PGS5.1 | 74.25,36.1 82.25,36.1
  Top 0.7: C45.2 39.6,15.6 C47.1 40.9,15.6 41.86,14.64 44.62,14.64 PGS4.2 50.39,14.5 C42.2 | D3.2 59.26,7.78 v61,7.78 63.23,7.78 66.12,4.88 66.5,4.88 | C70.2 57.62,18.73 C71.1 | 30.65,7.72 28.02,7.72 v28,7.75 25.98,7.75 D1.2
  Top 1: R52.1 8.12,14.64
  Bottom 0.5: 40.25,41.27 XT-CON.6 XT-CON.4 XT-CON.2 31.36,41.27 30.75,41.88 20.04,41.88 C4.2 19.73,40.5 | 40.25,41.27 XT-CON.8 | 40.25,41.27 40.25,36.98 | XT-CON.11 XT-CON.13 49.12,32.44 TR3.3 | IC1.4 21.78,13.6 22.75,12.62 C65.1 28,12.1 v28,7.75 | IC2.4 55.75,13.6 C68.1 59.9,12.1 | 19.73,40.5 19.73,40.19 18.25,40.19 U1.28 | C15.2 23.75,41.56 | C14.2 19.65,40.5 19.73,40.5 | C10.2 v30,30.38
  Bottom 0.7: C16.2 40.25,36.98 C17.2 | C10.2 C9.2 | C66.2 v39.75,10.4 | v61,7.78 61,11 59.9,12.1
  Bottom 1: Z1.2 5.9,16.02 5.9,14.75 | 5.9,14.75 C28.2 C27.2 C63.2 5.9,10.03 4.73,8.86 PWR.K | C29.- 5.9,14.75 | v3.38,16.62 5,16.62 5,17
  other vias: 39.75,21.25 31.5,41.25
  pour Bottom (isolate 0.5): 0,0 83,0 83,45 12,45 12,39 12.5,38.5 28.25,38.5 28.25,31.12 31.88,27.5 31.88,19.88 29,17 0,17
  pour Top (isolate 0.5): 0,45 83,45 83,0 0,0 0,18 15.62,18 29,31.38 29,40.12 28.75,40.62 16.12,40.62 1.62,26 1.62,18.25 0,18.25
N$1
  Top 0.7: R57.1 27.05,3.75 CH1_IN-.3
N$2
  Top 0.7: R58.1 11.85,5.2 CH1_IN+.3
N$3
  Bottom 0.5: U1.24 15.05,39.55 15.19,39.69 TDI.P$1
N$4
  Bottom 0.5: U1.23 14.25,39.5 14.06,39.69 TDO.P$1
N$5
  Bottom 0.5: U1.22 12.25,36.75 11.38,37.62 TMS.P$1
N$6
  Bottom 0.5: U1.21 10.38,35.95 TCK.P$1
N$7
  Top 0.7: 60.38,5.25 60.42,5.2 CH2_IN-.3 60.05,3.75 R59.1
N$9
  Top 0.4: D5.3 72.12,28.12 72.5,28.5 R56.2
  Top 0.5: C43.2 R35.1 C44.2 58,29 64.25,29 65.12,28.12 D5.3
N$10
  Top 0.7: R60.1 44.73,5.2 CH2_IN+.3
N$11
  Bottom 0.7: R62.1 3.38,12.85 PWR.A
N$12
  Bottom 0.5: R13.2 33.65,38.5 XT-CON.1
N$13
  Bottom 0.5: U1.2 21.45,28.5 22.5,28.5 23.86,27.14 AVR-ISP.1
N$14
  Bottom 0.5: U1.3 20.65,25.48 21.5,24.62 AVR-ISP.3
N$15
  Bottom 0.5: XT-CON.3 35.15,40 28.32,40 R14.2
N$16
  Bottom 0.5: AVR-ISP.4 25.75,24.62 24.5,25.88 22.25,25.88 U1.1
N$17
  Bottom 0.7: XT-CON.5 37.75,37.52 R15.2
N$18
  Bottom 0.7: XT-CON.7 42.75,37.48 R63.2
N$19
  Top 1.422: 8.12,19.38 8.12,17.88
N$21
  Bottom 0.5: C4.1 17.69,41.56 17.25,41.12 | 17.25,41.12 16.85,41.12 R2.1 | U1.27 17.45,40.42 17.25,40.62 17.25,41.12
N$22
  Top 0.406: R4.1 15.5,40.98 15.5,41.12
  Top 0.7: SR1.2 14.05,41.12 15.5,41.12 16.48,41.12 R5.2
N$23
  Bottom 0.5: P/C-CON.4 2.25,23.98 2.25,26.62 3.5,27.88 7.12,27.88 10,25 14.62,25 15.05,25.43 U1.10
N$24
  Bottom 0.5: U1.9 15.85,24.98 15,24.12 9.38,24.12 6.62,26.88 4.38,26.88 3.73,26.23 P/C-CON.6
N$25
  Bottom 0.5: U1.35 34.55,35.95 36.5,34 40.25,34 41,34.75 C17.1
  Bottom 0.7: R63.1 41.9,35.27 C17.1
N$26
  Bottom 0.5: U1.34 35.62,36.75 37.2,35.17 R15.1
  Bottom 0.7: R15.1 37.85,35.27 C16.1
N$27  (via drill 0.7)
  Top 0.5: Q1.2 14.88,34.25 v14.88,22.75 13.22,22.75 C3.1
  Bottom 0.5: U1.8 16.65,24.52 v14.88,22.75
N$28  (via drill 0.7)
  Top 0.5: Q1.1 22.06,32 16.62,32 v16.62,22.75 15,21.12 C2.1
  Bottom 0.5: U1.7 17.45,24.07 16.62,23.25 v16.62,22.75
N$29
  Bottom 0.5: R40.2 28.98,16.73 31.88,19.62 31.88,24.38 34.71,27.21 TR1.1
N$30
  Bottom 0.5: R41.2 58.12,18.5 57.5,19.12 51.35,19.12 TR2.1
N$31
  Top 0.7: R27.1 68.5,9.78 CH2_IN-.2 68.5,7.76 PGS3.2
N$35
  Bottom 0.5: C14.1 21.45,40.25 U1.32 21.45,37 22.5,37 24,38.5 R13.1
N$36
  Bottom 0.5: U1.33 22.25,39.77 C15.1 24.27,39.77 25,40.5 R14.1
N$81
  Bottom 0.7: R44.1 C55.2 19.88,12.1 R42.1
N$83
  Top 0.5: IC5.6 34.41,17.11 C51.1
N$84
  Top 0.5: IC5.2 30,18.39 30,14.4 R23.1
N$88
  Top 0.5: IC5.1 29.66,19.66 31.38,21.38 R24.1
N$92
  Top 0.4: D2.3 20.35,13.75 C40.1
  Top 0.7: R26.2 27.02,13.5 | 27.02,13.5 R53.2 26.75,12.88 25.88,12 C37.1 | D2.3 26.77,13.75 27.02,13.5 | R22.2 C40.1
N$93
  Top 0.4: D1.3 25,8.75 25.75,9.5
  Top 0.7: 33.48,12.47 R21.2 C39.2 | 33.48,12.47 33.08,12.88 R8.2 33.25,12.9 33.25,13.38 32.25,14.38 R23.2 | C37.2 25.75,9.5 30.5,9.5 33.48,12.47
N$94
  Top 0.4: D4.3 53.6,13.75 53.35,14
  Top 0.7: 60,14.35 R32.2 60.02,13.5 | 60.02,13.5 R55.2 59.75,12.88 58.88,12 C38.1 | C42.1 53.35,14 R28.2 | D4.3 59.77,13.75 60.02,13.5
N$95
  Top 0.4: D3.3 58.25,9 58.75,9.5
  Top 0.7: R29.2 R54.2 66.62,12.47 | C41.2 R27.2 66.62,12.47 | 66.62,12.47 66.47,12.47 63.5,9.5 58.75,9.5 C38.2
N$101
  Top 0.5: IC5.8 34.18,19.66 R25.1
N$102  (via drill 0.7)
  Top 0.7: C51.2 36.5,16.73 R36.1 35.1,15.6 v35,15.5
  Bottom 0.5: IC1.3 21.89,14.87 23,13.75 28,13.75 29.75,15.5 v35,15.5
N$103
  Top 0.5: R25.2 49.38,19.88 52.62,23.12 55.88,23.12 58.91,26.16 IC3.5
  Top 0.7: R25.2 R24.2
N$104
  Bottom 0.5: C55.1 17.88,12.15 17.88,16.75 18.53,17.41 IC1.1 22.72,17.41 23.4,16.73 R38.2 C53.2
N$105
  Bottom 0.5: IC1.2 22.36,16.14 23.38,15.12 24,15.12 | 24,15.12 25.5,15.12 | 25.5,15.12 26.9,15.12 R40.1 | C53.1 25.5,15.12 | R38.1 24,15.12
N$106
  Top 0.5: IC5.3 29,17.11 29,14.4 R26.1
N$107
  Bottom 0.5: IC1.5 14.65,12.2 R46.2
  Bottom 0.7: C59.1 R46.2
N$108
  Bottom 0.7: R46.1 C57.1 18.05,10.4 R44.2
N$109
  Bottom 0.5: R50.2 12.66,16.14 IC1.7 16.62,16.14 | 16.62,16.14 16.62,12.47 C57.2 | 16.62,16.14 16.62,16.88 18.25,18.5 23.38,18.5 23.88,18 28.62,18 30.75,20.12 30.75,27.62 28.25,30.12 R10.2
  Bottom 0.7: C61.2 R50.2
N$110
  Bottom 0.5: R50.1 12.28,13.65 13.49,14.87 IC1.6
  Bottom 0.7: R48.1 R50.1 C61.1
N$113  (via drill 0.7)
  Top 0.7: R37.1 69.1,15.75 | 69.1,15.75 C52.2 | 69.1,15.75 68.25,15.75 v68,15.62
  Bottom 0.5: v68,15.62 60.12,15.62 59.12,14.62 54.38,14.62 54.12,14.88 IC2.3
N$125
  Bottom 0.5: C56.1 50.88,12.4 50.88,17.41 IC2.1 54.16,17.41 54.35,17.6 55,17.6 R39.2 C54.2
N$126
  Bottom 0.5: IC2.2 54.12,16.14 54.35,15.9 55,15.9 R39.1 C54.1 R41.1
N$127
  Bottom 0.5: IC2.5 47.65,12.32 R47.2
  Bottom 0.7: C60.1 R47.2
N$128
  Bottom 0.7: R47.1 C58.1 51.05,10.4 R45.2
N$129
  Bottom 0.5: R9.2 33.12,28.75 33.75,28.12 35.5,28.12 36.38,29 38.88,29 49.62,18.25 49.62,16.14 | IC2.7 45.66,16.14 R51.2 | 49.62,16.12 49.62,16.14 IC2.7 | IC2.7 49.62,16.14 | 49.62,16.14 49.62,16.12 | 49.62,16.12 49.62,12.1 C58.2
  Bottom 0.7: C62.2 R51.2
N$130
  Bottom 0.5: IC2.6 46.49,14.87 45.27,13.65 R51.1
  Bottom 0.7: C62.1 R51.1 R49.1
N$131
  Bottom 0.7: R45.1 C56.2 52.88,12.1 R43.1
N$133
  Top 0.5: IC6.6 C52.1
N$134
  Top 0.5: IC6.1 62.16,19.66 63.5,21 R30.1
N$135
  Top 0.5: IC6.8 67.4,19.66 R31.1
N$136
  Top 0.5: IC3.3 69.1,24.89 R30.2
  Top 0.7: R31.2 R30.2
N$137
  Top 0.5: IC6.2 63.25,18.39 63.25,14.38 R29.1
N$138
  Top 0.5: IC6.3 62,17.11 62,14.38 R32.1
N$139
  Top 0.5: IC3.1 IC3.2 63.25,23.61 63.25,28.12 53.88,28.12 R34.2
N$140
  Top 0.5: IC3.7 IC3.6 62,24.89 62,27.25 52.5,27.25 R33.2
N$141  (via drill 0.7)
  Top 0.5: IC4.5 53.53,34.78 v53.16,34.41
  Bottom 0.5: v53.16,34.41 53.16,31.03 52.31,30.19 51.88,29.75 | 51.88,29.75 TR3.2 | TR3_DIS.1 51.62,29.5 51.88,29.75
N$142
  Top 0.5: R35.2 C44.1 58,32.24 IC4.7
N$144
  Bottom 0.7: R20.1 9.85,28.9 8.88,29.88 R19.2
N$145  (via drill 0.7)
  Top 0.5: R33.1 R34.1 C43.1 55.25,33.51 IC4.6 62,33.51 62,36 v61.62,36.38
  Bottom 0.7: XT-CON.12 48.19,42.88 52.91,42.88 DRL-OUT.3 59.41,36.38 v61.62,36.38
N$146
  Bottom 0.7: R16.2 R19.1 R17.2
N$148
  Bottom 0.5: R16.1 6.47,30.4 5.38,31.5 CAL.2
N$149
  Bottom 0.5: R18.1 6.68,33.65 CAL.1
PD5
  Bottom 0.5: U1.14 11,30.35 R20.2
PE
  Top 0.5: 8.12,22.5 8.12,20.5 | 8.12,22.5 P/C-CON.3 | C2.2 C3.2 8.12,22.62 8.12,22.5
  Top 1: 8.12,20.64 8.12,20.5 R52.2
  Bottom 0.5: 18.25,32.75 U1.39 25,32.75 25.75,32 25.75,28.38 25.12,27.75 25.12,26.5 25.75,25.88 28,25.88 | 18.25,32.75 U1.6 18.25,22.52 C7.2 | 18.25,32.75 17.45,33.55 U1.18 11.45,33.55 10.84,34.16 C8.2 | 28,25.88 28,23.19 27.91,23.1 C1.2 27.41,23.1 AVR-ISP.6 | C72.2 28,26.27 28,25.88
  Bottom 0.7: 18.25,22.52 18.25,22.12 17.38,21.25 16.5,21.25 | 16.5,21.25 15,21.25 | 15,21.25 14.03,21.25 C26.- 12.78,22.5 P/C-CON.3 | C25.2 15,21.25 | C24.2 16.38,21.12 16.5,21.25
  Bottom 1: P/C-CON.5 P/C-CON.3
  pour Bottom (isolate 0.5): 0,45 10.75,45 10.75,37.88 11.25,37.38 27,37.25 27,30.88 30.62,27.25 30.62,20.38 28.5,18.25 0,18.25
  pour Top (isolate 0.5): 2.75,26 2.62,19.12 15.12,19.12 27.75,31.75 27.75,39.12 16.25,39.12 3.12,26
RST
  Bottom 0.5: U1.4 19.85,24.52 22.44,21.94 | C1.1 28.25,21.38 27,20.12 25.32,20.12 23.86,21.59 | 22.44,21.94 22.79,21.59 23.86,21.59 | R1.2 22.44,21.84 22.44,21.94 | 23.86,21.59 AVR-ISP.5
VCC/2  (via drill 0.7, 0.8)
  Top 0.5: IC5.5 32.66,15.85 34.62,13.88 v35,13.88 | IC6.5 65.91,15.85 67.85,13.9 v68,13.9 | 69.5,14 69.4,13.9 R37.2 v68,13.9 | 68,13.88 v68,13.9 | IC4.1 IC4.2 67.5,32.24 | C31.1 v67.5,32.88 67.5,32.24 | 67.5,32.24 67.5,31.38 | 67.5,31.38 C32.+ | C30.1 67.5,31.38
  Top 0.7: R53.1 v30.12,12.88 | R8.1 v30.12,12.88 | v35,13.88 36.48,13.88 R36.2 C46.2 C47.2 40.35,13.9 42.62,11.62 v42.62,8.5 | R37.2 C49.2 71.72,13.9 72.5,13.12 C50.2 | R54.1 v63.12,12.88 | R55.1 v63.12,12.88 | v54.5,20.38 55.9,20.38 C69.2 56.12,18.73 C71.2 | CH1_IN-.4 29.23,11.1 30.12,12 v30.12,12.88 | CH2_IN-.4 62.23,11.1 63.12,12 v63.12,12.88 | CH2_IN+.4 47.5,10 v46.5,9 | CH1_IN+.4 14.5,10 v13.5,9
  Bottom 0.5: XT-CON.14 47.85,40 45.88,40 45.31,40.56 45.31,42.06 43.5,43.88 7.5,43.88 arc90 3.5,40 arc90 7.5,36.12 7.38,36.12 R18.2 R17.1
  Bottom 0.7: TR1.2 TR1.3 40.96,32.29 42.12,31.12 | R42.2 C65.2 | C64.2 R48.2 C59.2 13.38,9.75 13.56,9.56 | 13.56,9.56 15.62,7.5 19.85,7.5 C65.2 | v35,13.88 34,12.88 v30.12,12.88 30.12,7.12 29.25,6.25 26.75,6.25 22.75,10.25 C65.2 | C60.2 R49.2 C67.2 43.38,9.25 v42.62,8.5 | C60.2 46.38,9.75 48.62,7.5 53,7.5 54.25,8.75 | C68.2 R43.2 54.25,8.75 | 55.75,10.25 C68.2 | 55.75,10.38 C68.2 | 54.25,8.75 57.38,8.75 59.88,6.25 62.12,6.25 63.12,7.25 v63.12,12.88 67.75,12.88 68.44,13.56 | 68.44,13.56 69.62,14.75 69.62,20.5 | v68,13.9 68.1,13.9 68.44,13.56 | XT-CON.14 52.35,41.27 54.56,39.06 | 42.12,31.12 46.12,27.12 | 46.12,27.12 52.88,20.38 v54.5,20.38 69.5,20.38 69.62,20.5 | 54.56,39.06 64.25,29.38 | 69.62,20.5 69.62,24 64.25,29.38 | 64.25,29.38 64.25,29.62 v67.5,32.88 | TR2.2 TR2.3 43.27,32.27 42.12,31.12 | DRL-OUT.2 54.56,38.81 54.56,39.06 | 46.12,27.12 46.12,27.21 TR3.1 51.62,27.21 TR3_DIS.2 | v46.5,9 46.5,10.28 C60.2 | v13.5,9 13.5,9.5 13.56,9.56
VPP
  Bottom 0.5: C8.1 10.91,32.75 U1.17 14.25,32.75 14.25,28.75 13,27.5 9.12,27.5 7.62,29 3,29 1.12,27.12 1.12,22.88 2.75,21.25 8,21.25 L1.2 | U1.5 19.05,24.07 20.1,23.02 C7.1 | 26.62,30.1 26.62,32.38 25.45,33.55 U1.38 | R1.1 20.02,20.6 20.75,19.88 24,19.88 24.75,19.12 28.25,19.12 29.62,20.5 29.62,27.1 28.61,28.11 | 28.61,28.11 26.62,30.1 | C72.1 28.39,28.11 28.61,28.11 | AVR-ISP.2 26.62,27.39 26.62,30.1
  Bottom 0.7: 15,19.48 C26.+ 12.78,19.48 11.12,21.12 10,21.12 L2.1 | 15,19.48 16.45,19.48 | C25.1 15,19.48 | C24.1 16.45,19.48 | C7.1 19.94,22.34 19.94,21.21 R1.1 19,21.12 17.35,19.48 16.45,19.48
  Bottom 1: L1.2 L2.1
(copper drawn outside any net)
  shapes: Bottom circle x4, Top area x2, Top circle x4

### Text on the board
Top: EEG-ReMake | G-R-D | PROTO III | + | < | 1-2-D | D | 1+ | 2+
Bottom: EEG-RM |040218P03|